# Altium schematic sheet PWR_N3V0.SchDoc: Fast Servo
size 297 x 209 mm; Organization: Altium Limited; Address1: L3, 12a Rodborough Rd; Address2: Frenchs Forest; Address3: NSW; Address4: Australia 2086; DocumentNumber: 21; SheetNumber: 21; SheetTotal: 28; Title2: Power -3.0 V
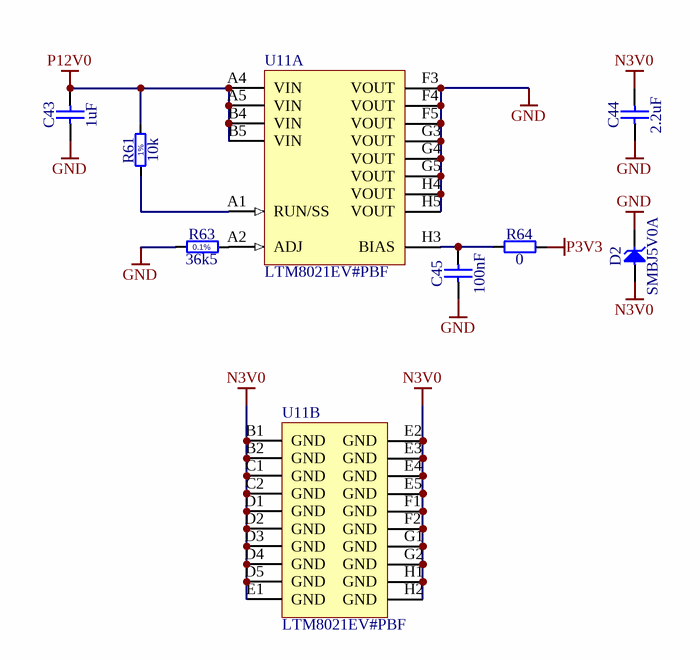
[diagram p0: PWR_N3V0.SchDoc]

## Parts
C43  1uF  [CAPC1608X87N]
C44  2.2uF  [CAPC1608X87N]
C45  100nF  [CAPC1005X55N]
D2  SMBJ5V0A  [DIOM5336X265N]
R61  10k  [RESC1005X40N]
R63  36k5  [RESC1608X55N]
R64  0  [RESC1005X40N]
U11  LTM8021EV#PBF  [LT-LGA-35-11250X6250X2820_V]  (parts A,B of 2)

## Nets
GND: C43.1 C44.1 C45.1 D2.1(C) R63.1 U11.F3(VOUT) U11.F4(VOUT) U11.F5(VOUT) U11.G3(VOUT) U11.G4(VOUT) U11.G5(VOUT) U11.H4(VOUT) U11.H5(VOUT)
N3V0: C44.2 D2.2(A) U11.B1(GND) U11.B2(GND) U11.C1(GND) U11.C2(GND) U11.D1(GND) U11.D2(GND) U11.D3(GND) U11.D4(GND) U11.D5(GND) U11.E1(GND) U11.E2(GND) U11.E3(GND) U11.E4(GND) U11.E5(GND) U11.F1(GND) U11.F2(GND) U11.G1(GND) U11.G2(GND) U11.H1(GND) U11.H2(GND)
P3V3: R64.2
P12V0: C43.2 R61.2 U11.A4(VIN) U11.A5(VIN) U11.B4(VIN) U11.B5(VIN)
NetC45_2: C45.2 R64.1 U11.H3(BIAS)
NetR61_1: R61.1 U11.A1(RUN/SS)
NetR63_2: R63.2 U11.A2(ADJ)

## Notes on the sheet
- Project
- Document
- Designer
- Drawn by
- Check.by
- File
- Last Mod.
- Print Date
- Sheet
- Size
- A4
- of
- Rev
- (in symbol R0402_10K_1%_0.0625W_100PPM) 1%
- (in symbol R0603_36K5_0.1%_0.063W_10PPM) 0.1%

## Library data of the parts
C43 = CC0603_1UF_25V_10%_X7R: Non-polarised capacitor; Part Description: SMD Multilayer Chip Ceramic Capacitor; Manufacturer: GENERIC; Manufacturer1 Part Number: GRM188R71E105KA12D; Voltage: 25V; TC: X7R; Tolerance: ±10%; Part Number: CC0603_1UF_25V_10%_X7R; Component Kind: Standard; Component Type: Standard; Pin Count: 2; Value: 1uF; Status: None; Manufacturer Part Number: CC0603_1UF_25V_10%_X7R; Case: 0603; Mounted: Yes; Socket: No; SMD: Yes; Sense: No; Manufacturer1 Example: MURATA; Manufacturer1 ComponentHeight: 0.9mm; HelpURL: \\cern.ch\dfs\Applications\Altium\Datasheets\CC0603_X7R_MURATA.pdf; Author: CERN DEM JLC; CreateDate: 18.01.2011; LatestRevisionDate: 18.01.2011
C44 = CC0603_2.2UF_16V_10%_X5R: Non-polarised capacitor; Part Description: SMD Multilayer Chip Ceramic Capacitor; Manufacturer: GENERIC; Manufacturer1 Part Number: CC0603KRX5R7BB225; Voltage: 16V; TC: X5R; Tolerance: ±10%; Part Number: CC0603_2.2UF_16V_10%_X5R; Component Kind: Standard; Component Type: Standard; Pin Count: 2; Value: 2.2uF; Status: Preferred; Manufacturer Part Number: CC0603_2.2UF_16V_10%_X5R; Case: 0603; Mounted: Yes; Socket: No; SMD: Yes; Sense: No; Manufacturer1 Example: YAGEO PHYCOMP; Manufacturer1 ComponentHeight: 0.9mm; HelpURL: \\cern.ch\dfs\Applications\Altium\Datasheets\CC0805_X5R_PHYCOMP_HC.pdf; Author: CERN DEM JLC; CreateDate: 28-Apr-11; LatestRevisionDate: 28-Apr-11
C45 = CC0402_100NF_16V_10%_X5R: Non-polarised capacitor; Part Description: SMD Multilayer Chip Ceramic Capacitor; Manufacturer: GENERIC; Manufacturer1 Part Number: GRM155R61C104KA88D; Voltage: 16V; TC: X5R; Tolerance: ±10%; Part Number: CC0402_100NF_16V_10%_X5R; Component Kind: Standard; Component Type: Standard; Pin Count: 2; Value: 100nF; Status: None; Manufacturer Part Number: CC0402_100NF_16V_10%_X5R; Case: 0402; Mounted: Yes; Socket: No; SMD: Yes; Sense: No; Manufacturer1 Example: MURATA; Manufacturer1 ComponentHeight: 0.55mm; HelpURL: \\cern.ch\dfs\Applications\Altium\Datasheets\CC0402_X5R_MURATA_GRM.pdf; Author: CERN DEM JLC; CreateDate: 10.12.2013; LatestRevisionDate: 10.12.2013
D2 = SMBJ5V0A: Zener Diode; Part Description: Uni-Directional Transient Voltage Suppressor Diode; Manufacturer: FAIRCHILD SEMICONDUCTOR; Voltage: 5V; Power: 600W; PressFit: No; Bonding: No; Part Number: SMBJ5V0A; Component Kind: Standard; Component Type: Standard; Device: SMBJ5V0A; PackageDescription: DO-214-AA/SMB Diode, Molded Body; 5.34mm L X 3.625mm W X 2.65mm H, IPC Medium Density; Manufacturer Part Number: SMBJ5V0A; Pin Count: 2; Case: DO-214AA; Mounted: Yes; Socket: No; SMD: Yes; Sense: No; ComponentHeight: 2.65mm; HelpURL: \\cern.ch\dfs\Applications\Altium\Datasheets\SMBJ.pdf; Author: CERN DEM JLC; CreateDate: 08-Dec-08; LatestRevisionDate: 19-Dec-11
R61 = R0402_10K_1%_0.0625W_100PPM: Resistor - 1%; Part Description: General Purpose Thick Film Chip Resistor; Manufacturer: GENERIC; Manufacturer1 Part Number: 232270671003L; PressFit: No; TC: ±100ppm/°C; Part Number: R0402_10K_1%_0.0625W_100PPM; Component Kind: Standard; Component Type: Standard; Pin Count: 2; Value: 10k; Status: Not Recommended; Manufacturer Part Number: R0402_10K_1%_0.0625W_100PPM; Case: 0402; Mounted: Yes; Sense: No; Socket: No; SMD: Yes; Manufacturer1 Example: YAGEO PHYCOMP; Manufacturer1 ComponentHeight: 0.4mm; HelpURL: \\cern.ch\dfs\Applications\Altium\Datasheets\R0402_Phycomp_RC0402.pdf; Author: CERN DEM JLC; CreateDate: 03-Dec-07; LatestRevisionDate: 17-Oct-12; Power: 0.0625W; Tolerance: ±1%
R63 = R0603_36K5_0.1%_0.063W_10PPM: Resistor - 0.1%; Part Description: Thin Film Chip Resistor; Manufacturer: GENERIC; Manufacturer1 Part Number: RN73C1J36K5BTDF; Power: 0.063W; TC: ±10ppm; PressFit: No; Part Number: R0603_36K5_0.1%_0.063W_10PPM; Component Kind: Standard; Component Type: Standard; Pin Count: 2; Value: 36k5; Status: Not Recommended; Tolerance: ±0.1%; Manufacturer Part Number: R0603_36K5_0.1%_0.063W_10PPM; Case: 0603; Mounted: Yes; Sense: No; Socket: No; SMD: Yes; Manufacturer1 Example: TYCO HOLSWORTHY; Manufacturer1 ComponentHeight: 0.5mm; HelpURL: \\cern.ch\dfs\Applications\Altium\Datasheets\R0603_Tyco_RN73.pdf; Author: CERN DEM JLC; CreateDate: 03-Dec-07; LatestRevisionDate: 13-Mar-08
R64 = R0402_0R_JUMPER: Resistor; Part Description: 1A (0.05R Max DC Resistance) Zero Ohm Jumper; Manufacturer: GENERIC; Manufacturer1 Part Number: 232270591001L; PressFit: No; Part Number: R0402_0R_JUMPER; Component Kind: Standard; Component Type: Standard; Pin Count: 2; Value: 0; Status: Not Recommended; Manufacturer Part Number: R0402_0R_JUMPER; Case: 0402; Mounted: Yes; Sense: No; Socket: No; SMD: Yes; Manufacturer1 Example: YAGEO PHYCOMP; Manufacturer1 ComponentHeight: 0.4mm; HelpURL: \\cern.ch\dfs\Applications\Altium\Datasheets\R0402_Phycomp_RC0402.pdf; Author: CERN DEM JLC; CreateDate: 03-Dec-07; LatestRevisionDate: 17-Oct-12
U11 = CMP-0483-00118-1: 36 VIN, 500 mA Step-Down DC/DC uModule, 35-pin LGA, -40 to 125 degC, Pb-Free, Tray; Manufacturer: Linear Technology; Frequency(kHz): 1100; Synchronous: no; Vin Max(V): 36; Extended Temp: E, I; Ishutdown(uA): 0.1; Isupply(mA): 1.5; Output Current(A): 0.5; Number of Outputs: 1; Vout Min(V): 0.8; Switch Current(A): 0.9; Vin Min(V): 3; Vout Max(V): 5; Topology: Buck; ComponentLink1Description: Manufacturer URL; Code_JEDEC: MO-222; ComponentLink2URL: http://cds.linear.com/docs/en/datasheet/8021fc.pdf; ComponentLink2Description: Datasheet; DatasheetVersion: Rev. C; Packing: Tray; RoHS: TRUE; Tracking: no; ComponentLink1URL: http://www.linear.com/; PackageDescription: 35-Pin LGA, Body 11.25 x 6.25 mm, Pitch 1.27 mm; ComponentLink3URL: http://cds.linear.com/docs/en/packaging/05081805_B_lga35.pdf; PackageReference: LGA-35; PartNumber: LTM8021EV#PBF; Mounting Technology: Surface Mount; PackageVersion: Rev. B, 02/2013; ComponentLink3Description: Package Specification